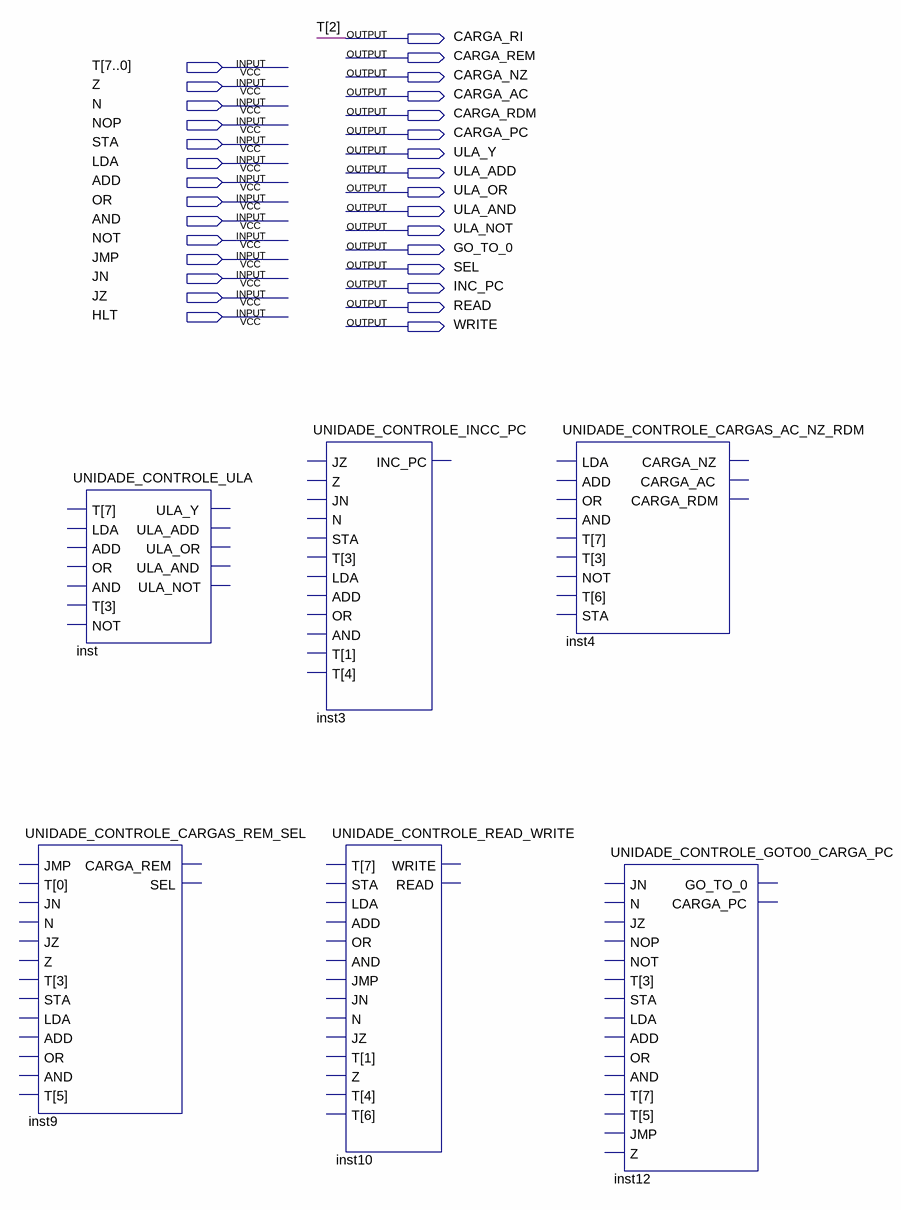
[diagram p0: schematic sheet]
// Quartus schematic UNIDADE_CONTROLE.bdf as structural Verilog: 6 symbols, 30 pins
module UNIDADE_CONTROLE (
  input  [7:0] T,
  input  Z,
  input  N,
  input  NOP,
  input  STA,
  input  LDA,
  input  ADD,
  input  OR,
  input  AND,
  input  NOT,
  input  JMP,
  input  JN,
  input  JZ,
  input  HLT,
  output CARGA_RI,
  output CARGA_REM,
  output CARGA_NZ,
  output CARGA_AC,
  output CARGA_RDM,
  output CARGA_PC,
  output ULA_Y,
  output ULA_ADD,
  output ULA_OR,
  output ULA_AND,
  output ULA_NOT,
  output GO_TO_0,
  output SEL,
  output INC_PC,
  output READ,
  output WRITE
);

  UNIDADE_CONTROLE_CARGAS_REM_SEL inst9 ();  // open: JMP, T, JN, N, JZ, Z, STA, LDA, ADD, OR, AND, CARGA_REM, SEL
  UNIDADE_CONTROLE_ULA inst ();  // open: T, LDA, ADD, OR, AND, NOT, ULA_Y, ULA_ADD, ULA_OR, ULA_AND, ULA_NOT
  UNIDADE_CONTROLE_INCC_PC inst3 ();  // open: JZ, Z, JN, N, STA, T, LDA, ADD, OR, AND, INC_PC
  UNIDADE_CONTROLE_READ_WRITE inst10 ();  // open: T, STA, LDA, ADD, OR, AND, JMP, JN, N, JZ, Z, WRITE, READ
  UNIDADE_CONTROLE_CARGAS_AC_NZ_RDM inst4 ();  // open: LDA, ADD, OR, AND, T, NOT, STA, CARGA_NZ, CARGA_AC, CARGA_RDM
  UNIDADE_CONTROLE_GOTO0_CARGA_PC inst12 ();  // open: JN, N, JZ, NOP, NOT, T, STA, LDA, ADD, OR, AND, JMP, Z, GO_TO_0, CARGA_PC

  assign CARGA_RI = T[2];
endmodule
